# Altium schematic sheet ST_LINK_SWD.SchDoc
size A2
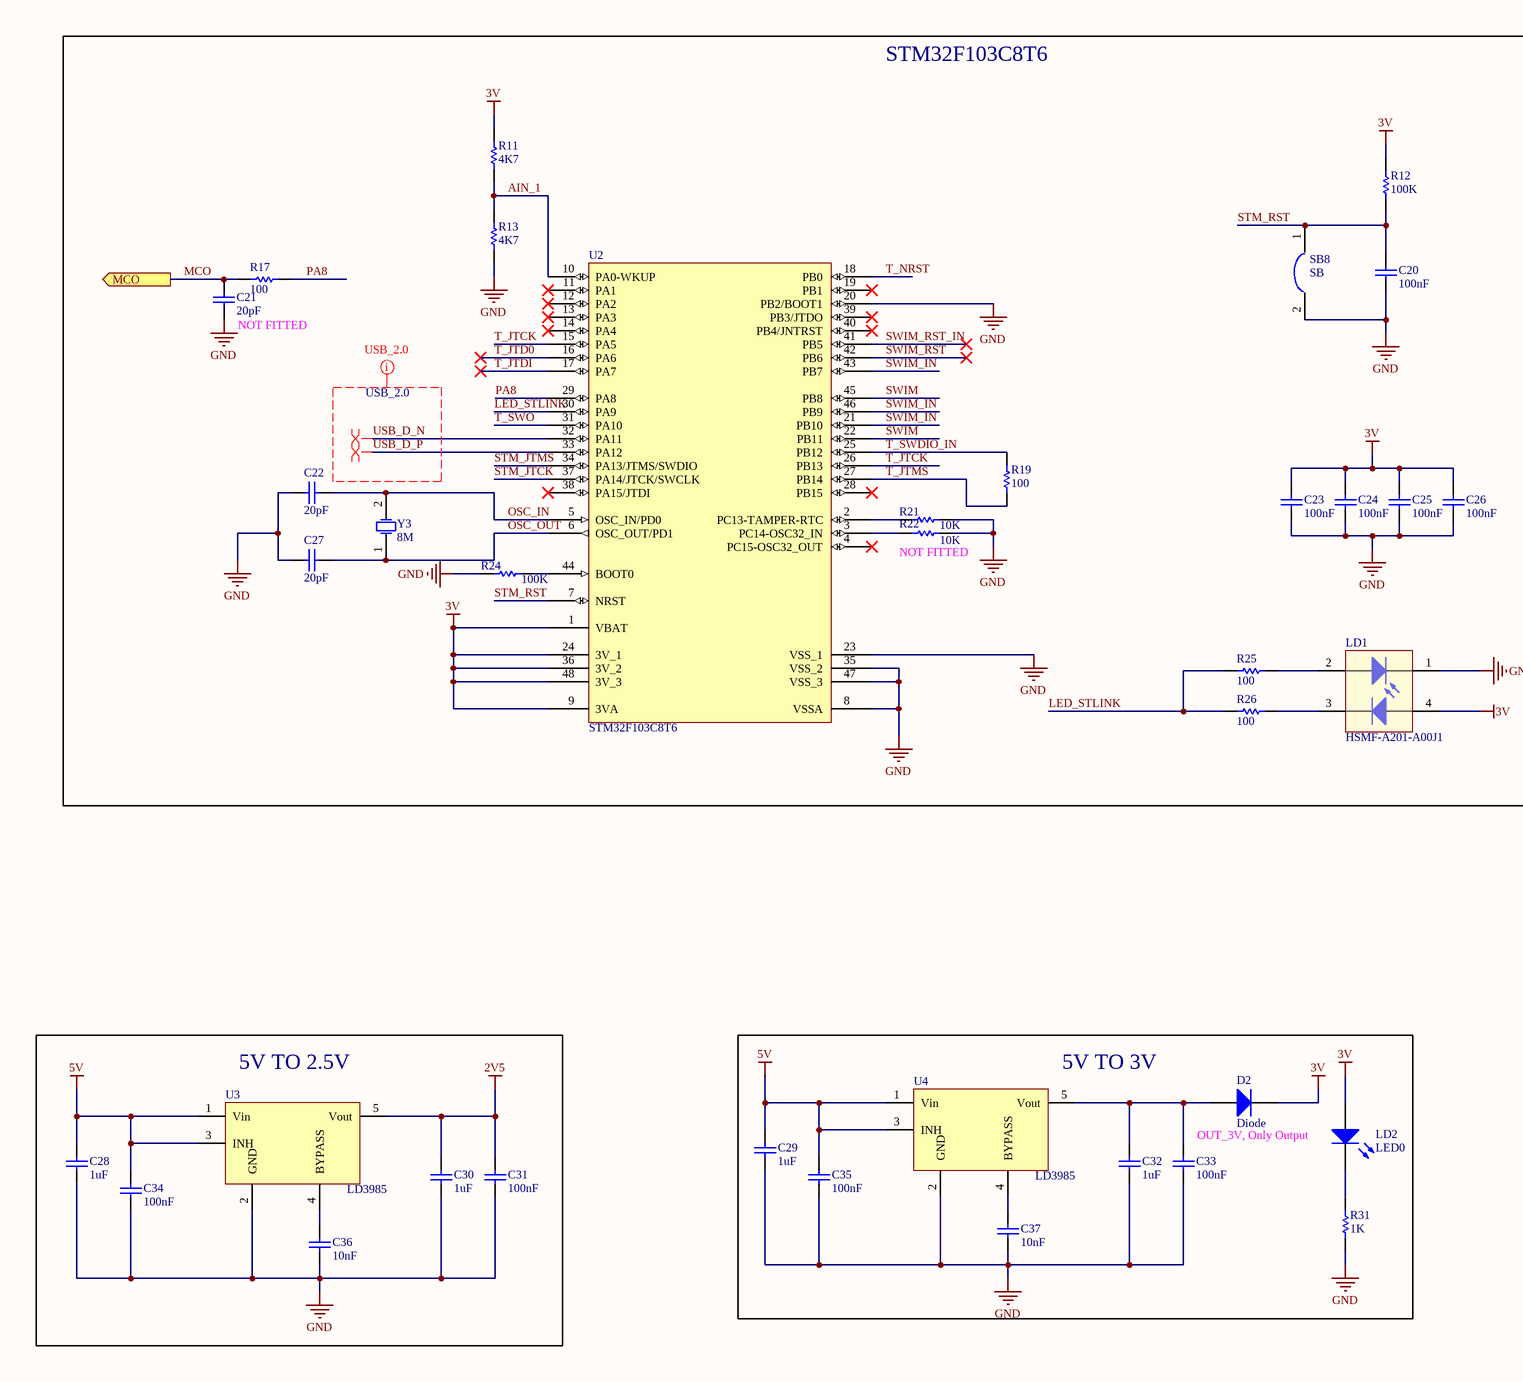
[diagram p0: ST_LINK_SWD.SchDoc, left]
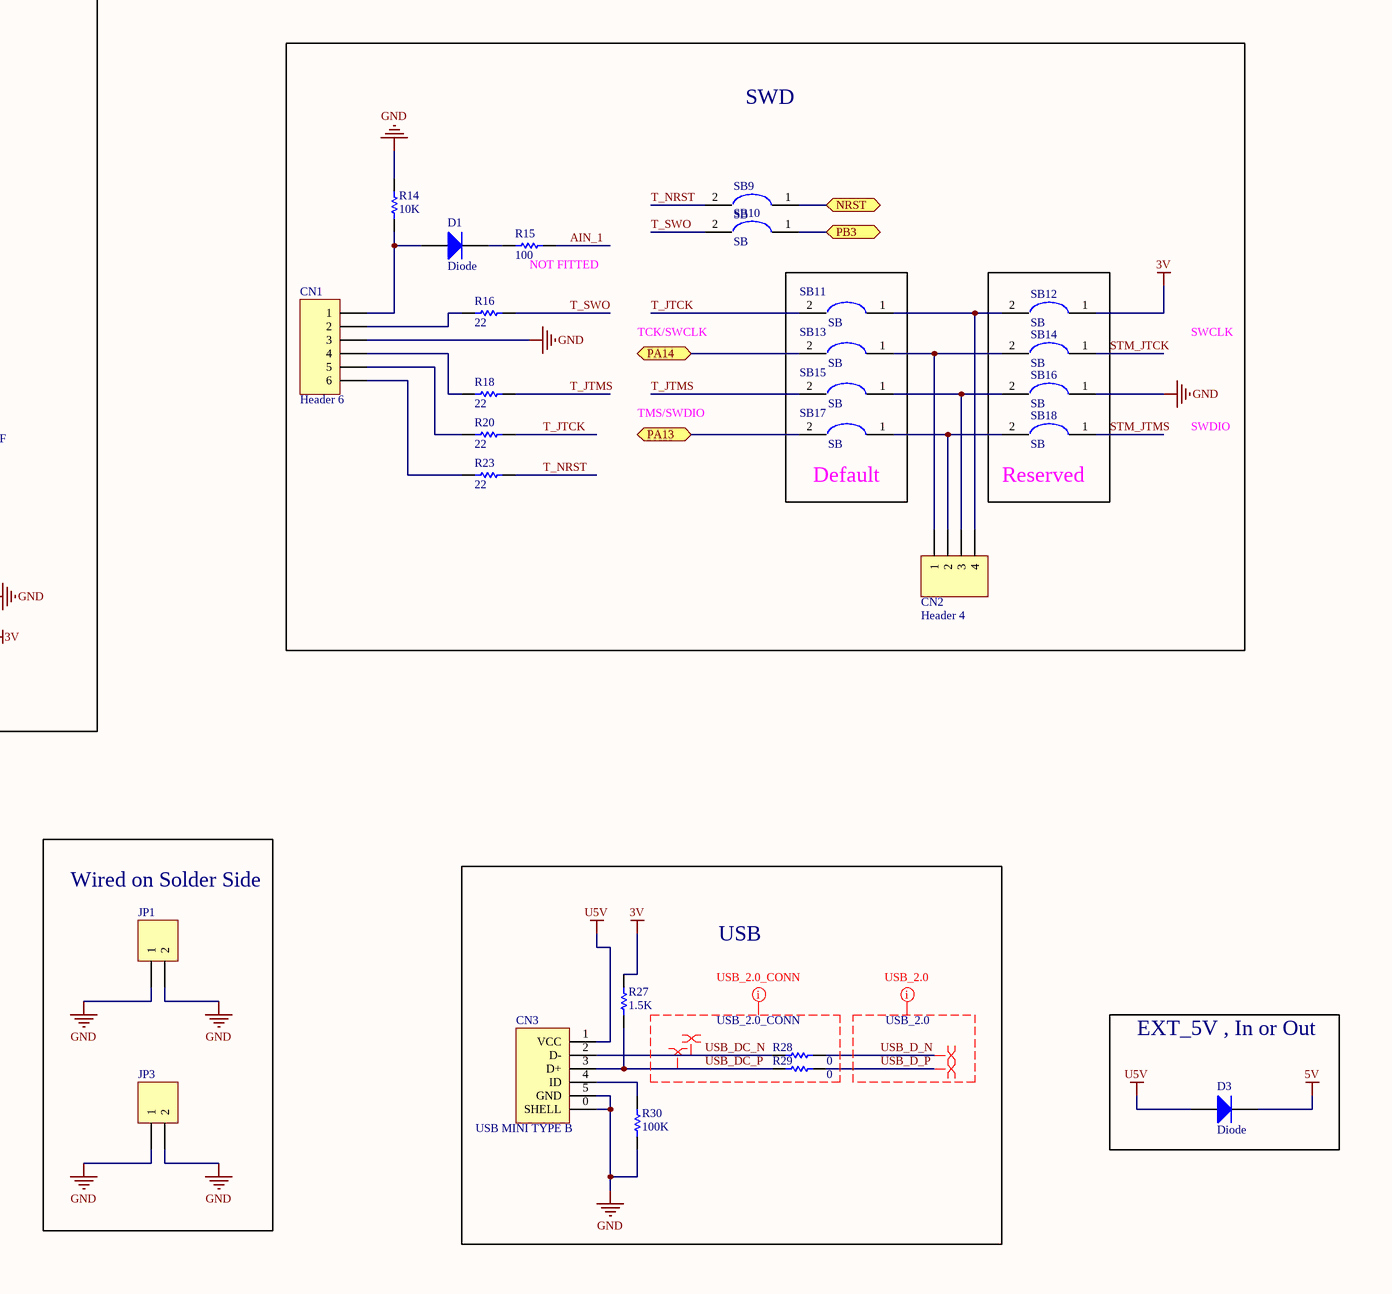
[diagram p1: ST_LINK_SWD.SchDoc, right]

## Parts
C20  value 100nF  [CAPC0603B]  (hidden comment: Cap)
C21  value 20pF  [CAPC0603B]  (hidden comment: Cap)
C22  value 20pF  [CAPC0603B]  (hidden comment: Cap)
C23  value 100nF  [CAPC0603B]  (hidden comment: Cap)
C24  value 100nF  [CAPC0603B]  (hidden comment: Cap)
C25  value 100nF  [CAPC0603B]  (hidden comment: Cap)
C26  value 100nF  [CAPC0603B]  (hidden comment: Cap)
C27  value 20pF  [CAPC0603B]  (hidden comment: Cap)
C28  value 1uF  [CAPC0603B]  (hidden comment: Cap)
C29  value 1uF  [CAPC0603B]  (hidden comment: Cap)
C30  value 1uF  [CAPC0603B]  (hidden comment: Cap)
C31  value 100nF  [CAPC0603B]  (hidden comment: Cap)
C32  value 1uF  [CAPC0603B]  (hidden comment: Cap)
C33  value 100nF  [CAPC0603B]  (hidden comment: Cap)
C34  value 100nF  [CAPC0603B]  (hidden comment: Cap)
C35  value 100nF  [CAPC0603B]  (hidden comment: Cap)
C36  value 10nF  [CAPC0402B]  (hidden comment: Cap)
C37  value 10nF  [CAPC0402B]  (hidden comment: Cap)
CN1  Header 6  [HDR1X6]
CN2  Header 4  [HDR1X4]
CN3  USB MINI TYPE B  [USB_MINI_TYPE_B]
D1  Diode  [SOD-323]
D2  Diode  [SOD-323]
D3  Diode  [SOD-323]
JP1  Header 2  [HDR1X2]  (value not drawn)
JP3  Header 2  [HDR1X2]  (value not drawn)
LD1  HSMF-A201-A00J1  [HSMF-A201-A00J1]
LD2  LED0  [LED_0603]
R11  value 4K7  [RESC0402B]  (hidden comment: Res1)
R12  value 100K  [RESC0402B]  (hidden comment: Res1)
R13  value 4K7  [RESC0402B]  (hidden comment: Res1)
R14  value 10K  [RESC0603B]  (hidden comment: Res1)
R15  value 100  [RESC0402B]  (hidden comment: Res1)
R16  value 22  [RESC0402B]  (hidden comment: Res1)
R17  value 100  [RESC0402B]  (hidden comment: Res1)
R18  value 22  [RESC0402B]  (hidden comment: Res1)
R19  value 100  [RESC0402B]  (hidden comment: Res1)
R20  value 22  [RESC0402B]  (hidden comment: Res1)
R21  value 10K  [RESC0603B]  (hidden comment: Res1)
R22  value 10K  [RESC0603B]  (hidden comment: Res1)
R23  value 22  [RESC0402B]  (hidden comment: Res1)
R24  value 100K  [RESC0402B]  (hidden comment: Res1)
R25  value 100  [RESC0402B]  (hidden comment: Res1)
R26  value 100  [RESC0402B]  (hidden comment: Res1)
R27  value 1.5K  [RESC0402B]  (hidden comment: Res1)
R28  value 0  [RESC0603B]  (hidden comment: Res1)
R29  value 0  [RESC0603B]  (hidden comment: Res1)
R30  value 100K  [RESC0402B]  (hidden comment: Res1)
R31  value 1K  [RESC0402B]  (hidden comment: Res1)
SB8  SB  [SB]
SB9  SB  [SB]
SB10  SB  [SB]
SB11  SB  [SB]
SB12  SB  [SB]
SB13  SB  [SB]
SB14  SB  [SB]
SB15  SB  [SB]
SB16  SB  [SB]
SB17  SB  [SB]
SB18  SB  [SB]
U2  STM32F103C8T6  [LQFP48_N]
U3  LD3985  [TSOT-23-5]
U4  LD3985  [TSOT-23-5]
Y3  8M  [HC-49S]

## Blocks framed on the sheet
STM32F103C8T6: C20-C27 LD1 R11-R13 R17 R19 R21 R22 R24-R26 SB8 U2 Y3
SWD: CN1 CN2 D1 R14-R16 R18 R20 R23 SB9 SB10
Default: SB11 SB13 SB15 SB17
Reserved: SB12 SB14 SB16 SB18
Wired on Solder Side: JP1 JP3
USB: CN3 R27-R30
5V TO 2.5V: C28 C30 C31 C34 C36 U3
5V TO 3V: C29 C32 C33 C35 C37 D2 LD2 R31 U4
EXT_5V , In or Out: D3

## Ports
MCO (out), NRST (bidir), PA13 (bidir), PA14 (bidir), PB3 (bidir)

## Nets
2V5: C30.2 C31.2 U3.5(Vout)
3V: C23.2 C24.2 C25.2 C26.2 D2.2(K) LD1.4 LD2.1(A) R11.2 R12.1 R27.2 SB12.1 U2.1(VBAT) U2.9(3VA) U2.24(3V_1) U2.36(3V_2) U2.48(3V_3)
5V: C28.2 C29.2 C34.2 C35.2 D3.2(K) U3.1(Vin) U3.3(INH) U4.1(Vin) U4.3(INH)
GND: C20.1 C21.1 C22.1 C23.1 C24.1 C25.1 C26.1 C27.1 C28.1 C29.1 C30.1 C31.1 C32.1 C33.1 C34.1 C35.1 C36.1 C37.1 CN1.3 CN3.0(SHELL) CN3.5(GND) JP1.1 JP1.2 JP3.1 JP3.2 LD1.1(A) R13.1 R14.2 R21.2 R22.2 R24.1 R30.2 R31.1 SB8.2 SB16.1 U2.8(VSSA) U2.20(PB2/BOOT1) U2.23(VSS_1) U2.35(VSS_2) U2.47(VSS_3) U3.2(GND) U4.2(GND)
U5V: CN3.1(VCC) D3.1(A)
AIN_1: R11.1 R13.2 R15.1 U2.10(PA0-WKUP)
LED_STLINK: R25.2 R26.2 U2.30(PA9)
MCO: C21.2 R17.2 ; port MCO
NRST: SB9.1 ; port NRST
OSC_IN: C22.2 U2.5(OSC_IN/PD0) Y3.2(OSC2)
OSC_OUT: C27.2 U2.6(OSC_OUT/PD1) Y3.1(OSC1)
PA8: R17.1 U2.29(PA8)
PA13: SB17.2 ; port PA13
PA14: SB13.2 ; port PA14
PB3: SB10.1 ; port PB3
STM_JTCK: SB14.1 U2.37(PA14/JTCK/SWCLK)
STM_JTMS: SB18.1 U2.34(PA13/JTMS/SWDIO)
STM_RST: C20.2 R12.2 SB8.1 U2.7(NRST)
SWIM: U2.22(PB11) U2.45(PB8)
SWIM_IN: U2.21(PB10) U2.43(PB7) U2.46(PB9)
SWIM_RST: U2.42(PB6)
SWIM_RST_IN: U2.41(PB5)
T_JTCK: R20.2 SB11.2 U2.15(PA5) U2.26(PB13)
T_JTD0: U2.16(PA6)
T_JTDI: U2.17(PA7)
T_JTMS: R18.2 R19.1 SB15.2 U2.27(PB14)
T_NRST: R23.2 SB9.2 U2.18(PB0)
T_SWDIO_IN: R19.2 U2.25(PB12)
T_SWO: R16.2 SB10.2 U2.31(PA10)
USB_D_N: R28.2 U2.32(PA11)
USB_D_P: R29.2 U2.33(PA12)
USB_DC_N: CN3.2(D-) R28.1
USB_DC_P: CN3.3(D+) R27.1 R29.1
NetC32_2: C32.2 C33.2 D2.1(A) U4.5(Vout)
NetC36_2: C36.2 U3.4(BYPASS)
NetC37_2: C37.2 U4.4(BYPASS)
NetCN1_1: CN1.1 D1.1(A) R14.1
NetCN1_2: CN1.2 R16.1
NetCN1_4: CN1.4 R18.1
NetCN1_5: CN1.5 R20.1
NetCN1_6: CN1.6 R23.1
NetCN2_1: CN2.1 SB13.1 SB14.2
NetCN2_2: CN2.2 SB17.1 SB18.2
NetCN2_3: CN2.3 SB15.1 SB16.2
NetCN2_4: CN2.4 SB11.1 SB12.2
NetCN3_4: CN3.4(ID) R30.1
NetD1_2: D1.2(K) R15.2
NetLD1_2: LD1.2(K) R25.1
NetLD1_3: LD1.3 R26.1
NetLD2_2: LD2.2(K) R31.2
NetR21_1: R21.1 U2.2(PC13-TAMPER-RTC)
NetR22_1: R22.1 U2.3(PC14-OSC32_IN)
NetR24_2: R24.2 U2.44(BOOT0)

Not connected (* = marked no-connect by the designer): U2 4(PC15-OSC32_OUT)* 11(PA1)* 12(PA2)* 13(PA3)* 14(PA4)* 19(PB1)* 28(PB15)* 38(PA15/JTDI)* 39(PB3/JTDO)* 40(PB4/JNTRST)*

## Layout directives
differential pair: USB_D_N, USB_D_P, USB_DC_N, USB_DC_P
net class USB_2.0: USB_D_N, USB_D_P
net class USB_2.0_CONN: USB_DC_N, USB_DC_P

## Notes on the sheet
- (near C21) NOT FITTED
- (near R15) NOT FITTED
- TCK/SWCLK
- SWCLK
- TMS/SWDIO
- SWDIO
- (near R22) NOT FITTED
- OUT_3V, Only Output
- Title
- Size:
- Date:
- File:
- A2
- Number:
- Time:
- Revision:
- Sheet
- of

## Library data of the parts
C20 C23-C26 C31 C33-C35 = Cap_3: Capacitor; Published: 8-Jun-2000; LatestRevisionDate: 17-Jul-2002; LatestRevisionNote: Re-released for DXP Platform.; PackageReference: RAD-0.3; Publisher: Altium Limited; PackageDescription: Radial Cap, Thru-Hole; 2 Leads; 0.3 in Pin Spacing
C21 C22 C27 = Cap: Capacitor; Published: 8-Jun-2000; LatestRevisionDate: 17-Jul-2002; LatestRevisionNote: Re-released for DXP Platform.; PackageReference: RAD-0.3; Publisher: Altium Limited; PackageDescription: Radial Cap, Thru-Hole; 2 Leads; 0.3 in Pin Spacing
C28-C30 C32 = Cap_4: Capacitor; Published: 8-Jun-2000; LatestRevisionDate: 17-Jul-2002; LatestRevisionNote: Re-released for DXP Platform.; PackageReference: RAD-0.3; Publisher: Altium Limited; PackageDescription: Radial Cap, Thru-Hole; 2 Leads; 0.3 in Pin Spacing
C36 C37 = Cap_7: Capacitor; Published: 8-Jun-2000; LatestRevisionDate: 17-Jul-2002; LatestRevisionNote: Re-released for DXP Platform.; PackageReference: RAD-0.3; Publisher: Altium Limited; PackageDescription: Radial Cap, Thru-Hole; 2 Leads; 0.3 in Pin Spacing
CN1 = Header 6: Header, 6-Pin; LatestRevisionDate: 17-Jul-2002; LatestRevisionNote: Re-released for DXP Platform.; Publisher: Altium Limited
CN2 = Header 4: Header, 4-Pin; LatestRevisionDate: 17-Jul-2002; LatestRevisionNote: Re-released for DXP Platform.; Publisher: Altium Limited
D1-D3 = Diode: Default Diode; Published: 8-Jun-2000; LatestRevisionDate: 17-Jul-2002; LatestRevisionNote: Re-released for DXP Platform.; PackageVersion: Sep-1996; PackageReference: SMC; Publisher: Altium Limited; PackageDescription: DO-214-AB/SMC; 2 C-Bend Leads; Body 7.9 x 5.9 mm, inc. leads (LxW); Code_JEDEC: DO-214-AB
JP1 JP3 = Header 2: Header, 2-Pin; LatestRevisionDate: 17-Jul-2002; LatestRevisionNote: Re-released for DXP Platform.; Publisher: Altium Limited
LD1 = HSMF-A201-A00J1: Manufacturer: Broadcom / Avago Technologies; Chip Material: GaP; DELETED: Compliant; Emitting Color: Red/Yellow Green; Forward Voltage: 2.6 V; Forward Current: 30/20 mA; Dominant Wave Length: 626/569 nm; Lum Intensity: 16/20mcd; High Brightness: No; Number of  Elements: 2; Main Category: Chip LED; Power Dissipation: 78/48 W; Peak Wavelength: 635/565 nm; Shape Type: Circular; Type: Bi-Color; Reverse Voltage: 5 V; Viewing Angle: 120 deg; Test Current (It): 20 mA; Product Depth (mm): 3.2 mm; Product Height (mm): 1.8 mm; Product Length (mm): 2.8 mm; Supplier 1: Digikey; Manufacturer Part Number: HSMF-A201-A00J1; Stock 1: 460; Pricing 1: 1=0.61, 10=0.472, 25=0.3932, 100=0.3388, 250=0.3025, 500=0.2602, 1000=0.2009 (USD); Mounting: Surface Mount; Operating Temp Range: -55C to 100C; Lens Dimensions: 2.2x2.2x0.8 mm; Luminous Intensity: 16/20mcd; Package Type: PLCC; Packaging: Tape and Reel; Pin Count: 4; Operating Temperature Classification: Industrial; Rad Hardened: No; ComponentLink1URL: https://datasheet.ciiva.com/29280/180547-da-01-en-plcc-4-led-hsmf-a201-a00j1-gelb-gruen-29280722.pdf; ComponentLink1Description: https://datasheet.ciiva.com/29280/180547-da-01-en-plcc-4-led-hsmf-a201-a00j1-gelb-gruen-29280722.pdf; ComponentLink2URL: https://datasheet.ciiva.com/11775/0900766b804ebe6b-11775846.pdf; ComponentLink2Description: https://datasheet.ciiva.com/11775/0900766b804ebe6b-11775846.pdf; ComponentLink3URL: https://datasheet.ciiva.com/4688/v02-0501en+ds+hsmx-a2xx+02feb2012-107193-4688327.pdf; ComponentLink3Description: https://datasheet.ciiva.com/4688/v02-0501en+ds+hsmx-a2xx+02feb2012-107193-4688327.pdf; ComponentLink4URL: https://datasheet.ciiva.com/15117/getdatasheetpartid-135296-15117690.pdf; ComponentLink4Description: https://datasheet.ciiva.com/15117/getdatasheetpartid-135296-15117690.pdf
LD2 = LED0: Typical INFRARED GaAs LED; Published: 8-Jun-2000; LatestRevisionDate: 08-Jul-2005; LatestRevisionNote: Mech Layer 1 removed.; PackageReference: LED-0; Publisher: Altium Limited; PackageDescription: LED; 2 Leads
R11 R13 = Res1_16: Resistor; Published: 8-Jun-2000; LatestRevisionDate: 17-Jul-2002; LatestRevisionNote: Re-released for DXP Platform.; PackageReference: AXIAL-0.3; Publisher: Altium Limited; PackageDescription: Axial Device, Thru-Hole; 2 Leads; 0.3 in Pin Spacing
R12 R24 R30 = Res1_5: Resistor; Published: 8-Jun-2000; LatestRevisionDate: 17-Jul-2002; LatestRevisionNote: Re-released for DXP Platform.; PackageReference: AXIAL-0.3; Publisher: Altium Limited; PackageDescription: Axial Device, Thru-Hole; 2 Leads; 0.3 in Pin Spacing
R14 R21 R22 = Res1_2: Resistor; Published: 8-Jun-2000; LatestRevisionDate: 17-Jul-2002; LatestRevisionNote: Re-released for DXP Platform.; PackageReference: AXIAL-0.3; Publisher: Altium Limited; PackageDescription: Axial Device, Thru-Hole; 2 Leads; 0.3 in Pin Spacing
R15 R17 R19 R25 R26 = Res1_4: Resistor; Published: 8-Jun-2000; LatestRevisionDate: 17-Jul-2002; LatestRevisionNote: Re-released for DXP Platform.; PackageReference: AXIAL-0.3; Publisher: Altium Limited; PackageDescription: Axial Device, Thru-Hole; 2 Leads; 0.3 in Pin Spacing
R16 R18 R20 R23 = Res1_11: Resistor; Published: 8-Jun-2000; LatestRevisionDate: 17-Jul-2002; LatestRevisionNote: Re-released for DXP Platform.; PackageReference: AXIAL-0.3; Publisher: Altium Limited; PackageDescription: Axial Device, Thru-Hole; 2 Leads; 0.3 in Pin Spacing
R27 = Res1_15: Resistor; Published: 8-Jun-2000; LatestRevisionDate: 17-Jul-2002; LatestRevisionNote: Re-released for DXP Platform.; PackageReference: AXIAL-0.3; Publisher: Altium Limited; PackageDescription: Axial Device, Thru-Hole; 2 Leads; 0.3 in Pin Spacing
R28 R29 = Res1: Resistor; Published: 8-Jun-2000; LatestRevisionDate: 17-Jul-2002; LatestRevisionNote: Re-released for DXP Platform.; PackageReference: AXIAL-0.3; Publisher: Altium Limited; PackageDescription: Axial Device, Thru-Hole; 2 Leads; 0.3 in Pin Spacing
R31 = Res1_17: Resistor; Published: 8-Jun-2000; LatestRevisionDate: 17-Jul-2002; LatestRevisionNote: Re-released for DXP Platform.; PackageReference: AXIAL-0.3; Publisher: Altium Limited; PackageDescription: Axial Device, Thru-Hole; 2 Leads; 0.3 in Pin Spacing
U2 = STM32F103C8T6: STM32 ARM-based 32-bit MCU with 64 Kbytes Flash, 48-pin LQFP, Industrial Temperature; Published: 30-May-2008; DatasheetVersion: rev6, Mar-2008; PackageVersion: Mar-2008; PackageReference: LQFP48; Publisher: Altium Limited; PackageDescription: 48-Pin Low-Profile Quad Flat Pack, 7 x 7 mm Body, 0.5 mm Pitch (LQFP48); ComponentLink1Description: Manufacturer Link; ComponentLink1URL: www.st.com/stm32; ComponentLink2Description: Datasheet; ComponentLink2URL: http://www.st.com/stonline/products/literature/ds/13587.pdf
U3 U4 = LD3985: Manufacturer: STMicroelectronics; Manufacturer Part Number: LD3985G33R; Other Related Documents: LD3985XX33 View All Specifications LD3985XX33 View All Specifications; EDA / CAD Models: Download from Accelerated Designs; Regulator Topology: Positive Fixed; Voltage - Output: 3.3V; Current - Output: 150mA; Voltage - Dropout (Typical): 0.06V @ 150mA; Number of Regulators: 1; Voltage - Input: Up to 6V; Current - Limit (Min): 300mA; Other Names: 497-7793-6; Supplier 1: Digikey; Stock 1: 937; Pricing 1: 1=0.65, 10=0.574, 100=0.4404, 500=0.3481 (USD); Standard Package: 1; Category: Integrated Circuits (ICs); Family: PMIC - Voltage Regulators - Linear; Series: -; Packaging: Digi-Reel®; Operating Temperature: -40°C ~ 125°C; Mounting Type: Surface Mount; Package / Case: SOT-23-5 Thin, TSOT-23-5; Supplier Device Package: TSOT-23-5; ComponentLink1URL: https://datasheet.ciiva.com/2053/cd00003395-2053393.pdf; ComponentLink1Description: https://datasheet.ciiva.com/2053/cd00003395-2053393.pdf; ComponentLink2URL: https://datasheet.ciiva.com/2053/cd00003395-2053394.pdf; ComponentLink2Description: https://datasheet.ciiva.com/2053/cd00003395-2053394.pdf; ComponentLink3URL: https://datasheet.ciiva.com/2053/cd00003395-2053395.pdf; ComponentLink3Description: https://datasheet.ciiva.com/2053/cd00003395-2053395.pdf
Y3 = XTAL: Crystal Oscillator; Published: 8-Jun-2000; LatestRevisionDate: 17-Jul-2002; LatestRevisionNote: Re-released for DXP Platform.; PackageReference: R38; Publisher: Altium Limited; PackageDescription: Crystal, Thru-Hole; 2 Leads; Body 3.1 x 8.2 mm (Dia.xH)
CN3 = USB MINI TYPE B: Component Type: Connector